# EAGLE design Adafruit TFP401 to 40pin TFT (EAGLE 6.3)
COMPANY: ADAFRUIT INDUSTRIES; DRAWN: FZHAO; REV: C
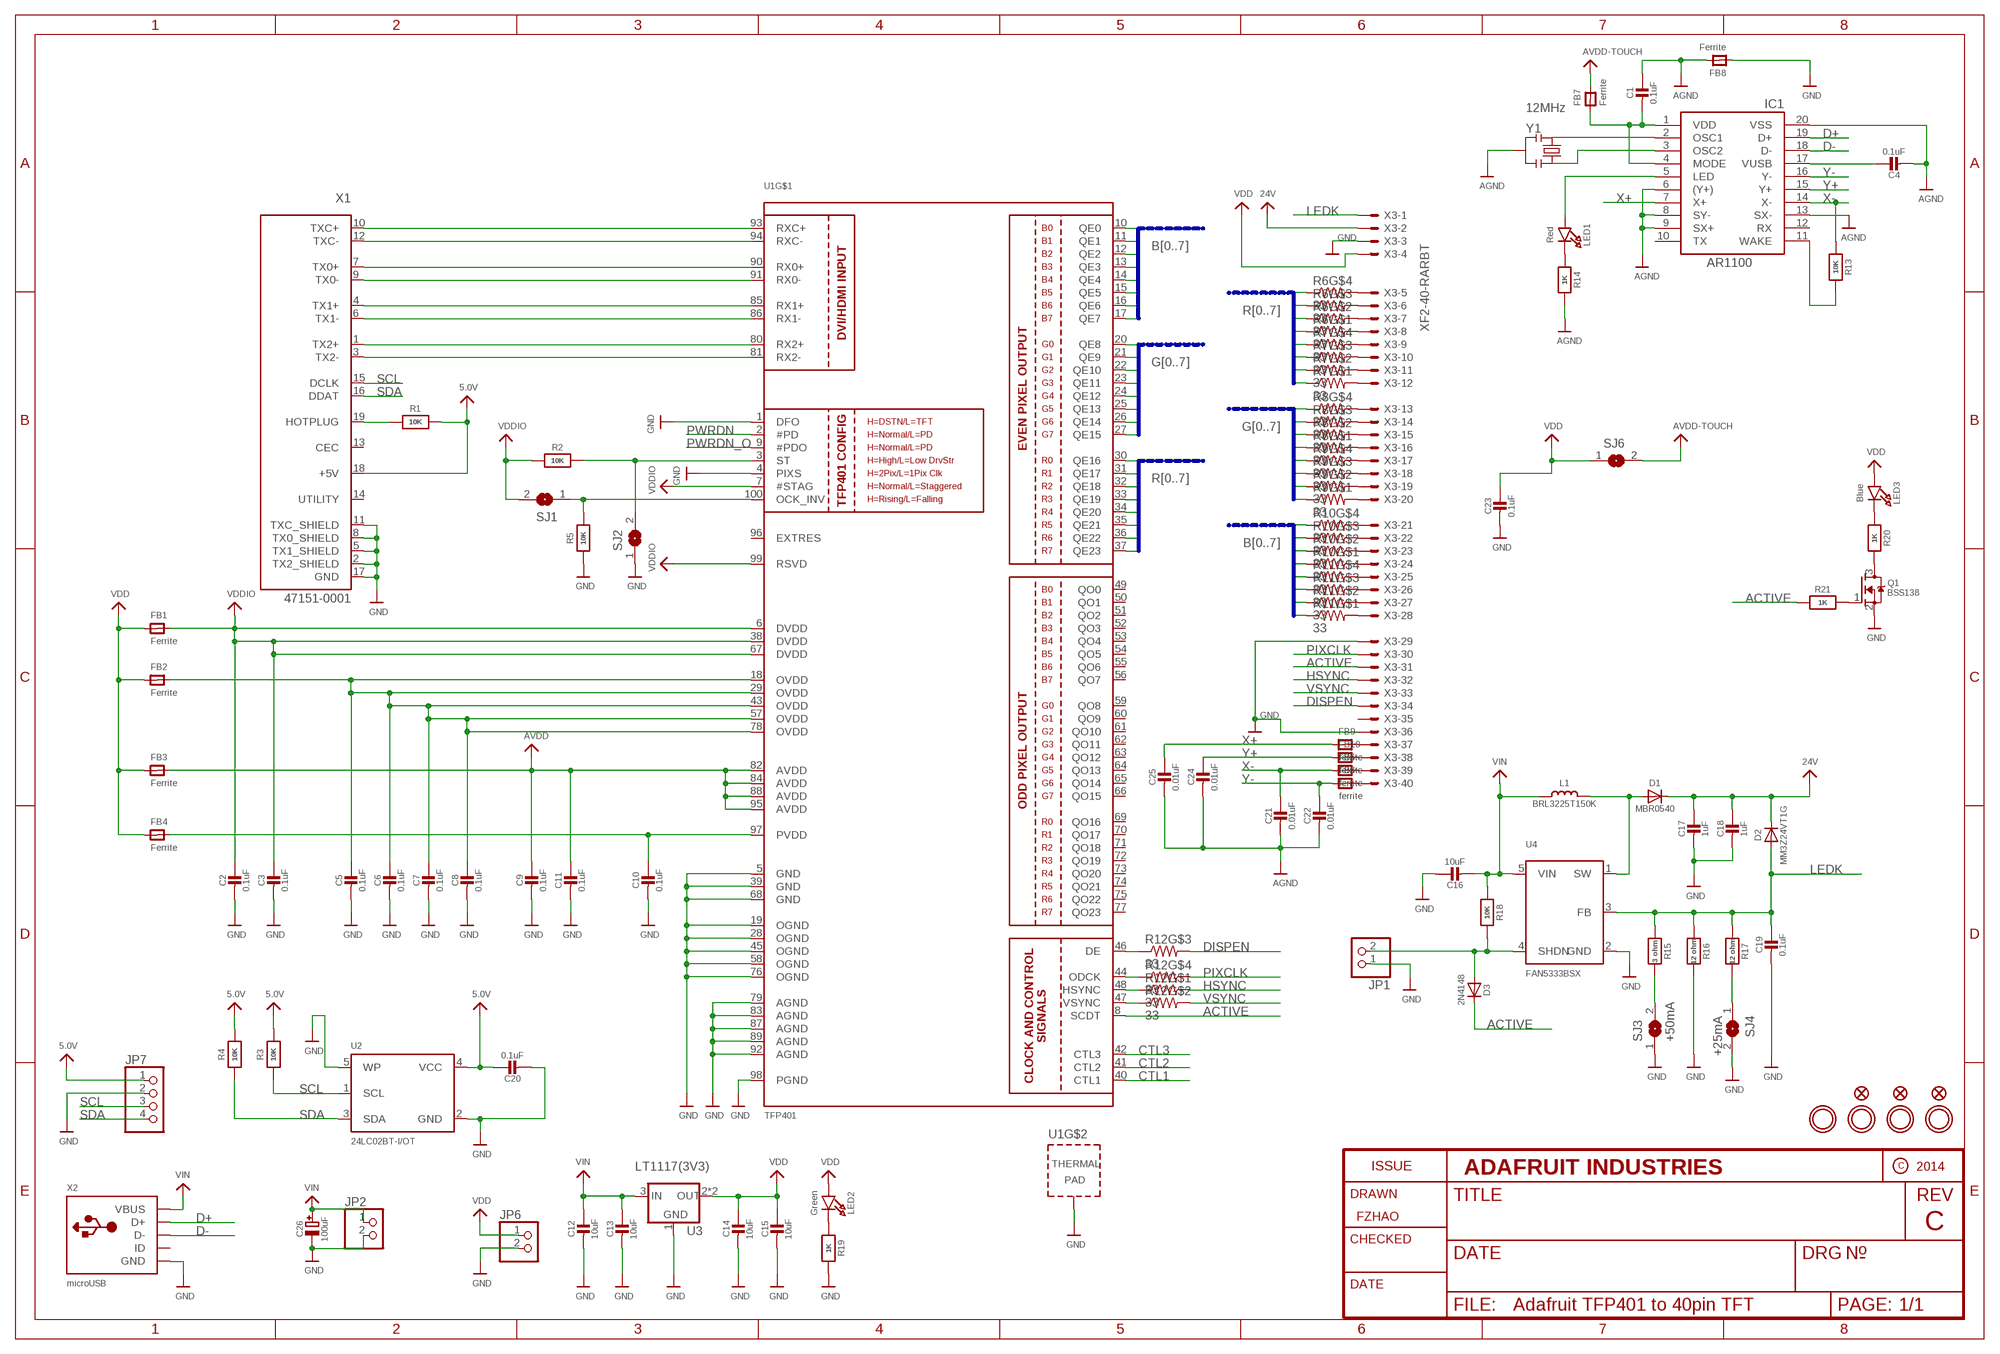
[diagram p0: schematic, sheet 1]

## Parts
C1  0.1uF  CAP_CERAMIC0805-NOOUTLINE  [0805-NO]
C2  0.1uF  CAP_CERAMIC0805-NOOUTLINE  [0805-NO]
C3  0.1uF  CAP_CERAMIC0805-NOOUTLINE  [0805-NO]
C4  0.1uF  CAP_CERAMIC0805-NOOUTLINE  [0805-NO]
C5  0.1uF  CAP_CERAMIC0805-NOOUTLINE  [0805-NO]
C6  0.1uF  CAP_CERAMIC_0805MP  [_0805MP]
C7  0.1uF  CAP_CERAMIC0805-NOOUTLINE  [0805-NO]
C8  0.1uF  CAP_CERAMIC0805-NOOUTLINE  [0805-NO]
C9  0.1uF  CAP_CERAMIC0805-NOOUTLINE  [0805-NO]
C10  0.1uF  CAP_CERAMIC0805-NOOUTLINE  [0805-NO]
C11  0.1uF  CAP_CERAMIC0805-NOOUTLINE  [0805-NO]
C12  10uF  CAP_CERAMIC0805-NOOUTLINE  [0805-NO]
C13  10uF  CAP_CERAMIC0805-NOOUTLINE  [0805-NO]
C14  10uF  CAP_CERAMIC0805-NOOUTLINE  [0805-NO]
C15  10uF  CAP_CERAMIC0805-NOOUTLINE  [0805-NO]
C16  10uF  CAP_CERAMIC0805-NOOUTLINE  [0805-NO]
C17  1uF  CAP_CERAMIC0805-NOOUTLINE  [0805-NO]
C18  1uF  CAP_CERAMIC0805-NOOUTLINE  [0805-NO]
C19  0.1uF  CAP_CERAMIC0805-NOOUTLINE  [0805-NO]
C20  0.1uF  CAP_CERAMIC0805-NOOUTLINE  [0805-NO]
C21  0.01uF  CAP_CERAMIC0805-NOOUTLINE  [0805-NO]
C22  0.01uF  CAP_CERAMIC0805-NOOUTLINE  [0805-NO]
C23  0.1uF  CAP_CERAMIC0805-NOOUTLINE  [0805-NO]
C24  0.01uF  CAP_CERAMIC0805-NOOUTLINE  [0805-NO]
C25  0.01uF  CAP_CERAMIC0805-NOOUTLINE  [0805-NO]
C26  100uF  CAP_ELECTROLYTICPANASONIC_C  [PANASONIC_C]
D1  MBR0540  DIODESOD-123  [SOD-123]
D2  MM3Z24VT1G  DIODESMA  [SMADIODE]
D3  2N4148  DIODESOD-323  [SOD-323]
FB1  Ferrite  FERRITE_0805MP  [_0805MP]
FB2  Ferrite  FERRITE_0805MP  [_0805MP]
FB3  Ferrite  FERRITE_0805MP  [_0805MP]
FB4  Ferrite  FERRITE_0805MP  [_0805MP]
FB5  ferrite  FERRITE_0805MP  [_0805MP]
FB6  ferrite  FERRITE_0805MP  [_0805MP]
FB7  Ferrite  FERRITE_0805MP  [_0805MP]
FB8  Ferrite  FERRITE_0805MP  [_0805MP]
FB9  ferrite  FERRITE_0805MP  [_0805MP]
FB10  ferrite  FERRITE_0805MP  [_0805MP]
FID1  FIDUCIAL""  [FIDUCIAL_1MM]
FID2  FIDUCIAL""  [FIDUCIAL_1MM]
FID3  FIDUCIAL""  [FIDUCIAL_1MM]
IC1  AR1100_SSOP  [TSSOP20-5.3MMBODY]
JP1  HEADER-1X2ROUND  [1X02_ROUND]
JP2  HEADER-1X2ROUND  [1X02_ROUND]
JP6  HEADER-1X2ROUND  [1X02_ROUND]
JP7  HEADER-1X476MIL  [1X04_ROUND_76]
L1  BRL3225T150K  INDUCTORNR5040  [INDUCTOR_5X5MM_NR5040_NOTHERMALS]
LED1  Red  LED0805_NOOUTLINE  [CHIPLED_0805_NOOUTLINE]
LED2  Green  LED0805_NOOUTLINE  [CHIPLED_0805_NOOUTLINE]
LED3  Blue  LED0805_NOOUTLINE  [CHIPLED_0805_NOOUTLINE]
Q1  BSS138  MOSFET-NREFLOW  [SOT23-R]
R1  10K  RESISTOR0805_NOOUTLINE  [0805-NO]
R2  10K  RESISTOR0805_NOOUTLINE  [0805-NO]
R3  10K  RESISTOR0805_NOOUTLINE  [0805-NO]
R4  10K  RESISTOR0805_NOOUTLINE  [0805-NO]
R5  10K  RESISTOR_0805MP  [_0805MP]
R6  33  RESISTOR_4PACK_US  [RESPACK_4X0603]
R7  33  RESISTOR_4PACK_US  [RESPACK_4X0603]
R8  33  RESISTOR_4PACK_US  [RESPACK_4X0603]
R9  33  RESISTOR_4PACK_US  [RESPACK_4X0603]
R10  33  RESISTOR_4PACK_US  [RESPACK_4X0603]
R11  33  RESISTOR_4PACK_US  [RESPACK_4X0603]
R12  33  RESISTOR_4PACK_US  [RESPACK_4X0603]
R13  10K  RESISTOR_0805MP  [_0805MP]
R14  1K  RESISTOR0805_NOOUTLINE  [0805-NO]
R15  3 ohm  RESISTOR0805_NOOUTLINE  [0805-NO]
R16  12 ohm  RESISTOR0805_NOOUTLINE  [0805-NO]
R17  12 ohm  RESISTOR0805_NOOUTLINE  [0805-NO]
R18  10K  RESISTOR0805_NOOUTLINE  [0805-NO]
R19  1K  RESISTOR0805_NOOUTLINE  [0805-NO]
R20  1K  RESISTOR0805_NOOUTLINE  [0805-NO]
R21  1K  RESISTOR0805_NOOUTLINE  [0805-NO]
SJ1  SOLDERJUMPER  [SOLDERJUMPER_ARROW_NOPASTE]
SJ2  SOLDERJUMPER  [SOLDERJUMPER_ARROW_NOPASTE]
SJ3  +50mA  SOLDERJUMPER  [SOLDERJUMPER_ARROW_NOPASTE]
SJ4  +25mA  SOLDERJUMPER  [SOLDERJUMPER_ARROW_NOPASTE]
SJ6  SOLDERJUMPERCLOSED  [SOLDERJUMPER_CLOSEDWIRE]
U1  TFP401  [S-PQFP-G100]
U2  24LC02BT-I/OT  EEPROM_I2C_MCP24AA32  [SOT23-5]
U3  LT1117(3V3)  VREG_SOT223  [SOT223-R]
U4  FAN5333BSX  VREG_FAN5331  [SOT23-5]
U$31  MOUNTINGHOLE3.0  [MOUNTINGHOLE_3.0_PLATED]
U$32  MOUNTINGHOLE3.0  [MOUNTINGHOLE_3.0_PLATED]
U$33  MOUNTINGHOLE3.0  [MOUNTINGHOLE_3.0_PLATED]
U$34  MOUNTINGHOLE3.0  [MOUNTINGHOLE_3.0_PLATED]
X1  47151-0001  HDMI_MOLEX_47151DIM  [HDMI_MOLEX_47151-0001_DIMLAYER]
X2  microUSB  USBMICRO_20329  [4UCONN_20329]
X3  XF2-40-RARBT  [4-1734839-0]
Y1  12MHz  RESONATORSMD  [RESONATOR-SMD]

## Nets
5.0V: C20.1 JP7.1 R1.2 R3.2 R4.2 U2.4(VCC) X1.18(+5V)
24V: C17.1 C18.1 D1.C D2.C X3.2
ACTIVE: D3.C R21.1 U1.8(SCDT) X3.31
AGND: C1.1 C4.2 C21.2 C22.2 C24.2 C25.2 FB8.2 IC1.6((Y+)) IC1.8(SY-) IC1.9(SX+) IC1.13(SX-) IC1.20(VSS) R14.2 Y1.2
ASD: R12.3 U1.46(DE)
AVDD: C9.1 C11.1 FB3.2 U1.82(AVDD) U1.84(AVDD) U1.88(AVDD) U1.95(AVDD)
AVDD2: FB7.2 SJ6.2 ; supply symbol labelled AVDD-TOUCH
B0: R10.4 U1.10(QE0)
B1: R10.3 U1.11(QE1)
B2: R10.2 U1.12(QE2)
B3: R10.1 U1.13(QE3)
B4: R11.4 U1.14(QE4)
B5: R11.3 U1.15(QE5)
B6: R11.2 U1.16(QE6)
B7: R11.1 U1.17(QE7)
CTL1: U1.40(CTL1)
CTL2: U1.41(CTL2)
CTL3: U1.42(CTL3)
CVB: R12.2 U1.47(VSYNC)
D+: IC1.19(D+) X2.D+
D-: IC1.18(D-) X2.D-
DISPEN: R12.6 X3.34
G0: R8.4 U1.20(QE8)
G1: R8.3 U1.21(QE9)
G2: R8.2 U1.22(QE10)
G3: R8.1 U1.23(QE11)
G4: R9.4 U1.24(QE12)
G5: R9.3 U1.25(QE13)
G6: R9.2 U1.26(QE14)
G7: R9.1 U1.27(QE15)
GND: C2.2 C3.2 C5.2 C6.2 C7.2 C8.2 C9.2 C10.2 C11.2 C12.2 C13.2 C14.2 C15.2 C16.1 C17.2 C18.2 C19.2 C20.2 C23.2 C26.- FB8.1 JP1.1 JP2.2 JP6.2 JP7.2 Q1.2(S) R5.1 R16.2 R19.2 SJ2.1 SJ3.1 SJ4.2 U1.1(DFO) U1.4(PIXS) U1.5(GND) U1.19(OGND) U1.28(OGND) U1.39(GND) U1.45(OGND) U1.58(OGND) U1.68(GND) U1.76(OGND) U1.79(AGND) U1.83(AGND) U1.87(AGND) U1.89(AGND) U1.92(AGND) U1.98(PGND) U1.P$1(TP) U1.P$2(TP) U1.P$3(TP) U1.P$4(TP) U1.P$5(TP) U1.P$6(TP) U1.P$7(TP) U1.P$8(TP) U1.P$9(TP) U1.P$10(TP) U1.P$11(TP) U1.P$12(TP) U1.P$13(TP) U1.P$14(TP) U1.P$15(TP) U1.P$16(TP) U1.THERMAL(TP) U2.2(GND) U2.5(WP) U3.1(GND) U4.2(GND) X1.2(TX2_SHIELD) X1.5(TX1_SHIELD) X1.8(TX0_SHIELD) X1.11(TXC_SHIELD) X1.17(GND) X2.BASE@1(GND) X2.BASE@2(GND) X2.GND X2.SPRT@1(GND) X2.SPRT@2(GND) X2.SPRT@3(GND) X2.SPRT@4(GND) X3.3 X3.29 X3.36
HSYNC: R12.8 X3.32
LEDK: C19.1 D2.A R15.1 R16.1 R17.1 U4.3(FB) X3.1
N$1: U1.93(RXC+) X1.10(TXC+)
N$2: U1.94(RXC-) X1.12(TXC-)
N$3: U1.90(RX0+) X1.7(TX0+)
N$4: U1.91(RX0-) X1.9(TX0-)
N$5: U1.85(RX1+) X1.4(TX1+)
N$6: U1.86(RX1-) X1.6(TX1-)
N$7: U1.80(RX2+) X1.1(TX2+)
N$8: U1.81(RX2-) X1.3(TX2-)
N$9: R1.1 X1.19(HOTPLUG)
N$10: IC1.2(OSC1) Y1.1
N$11: IC1.3(OSC2) Y1.3
N$12: C4.1 IC1.17(VUSB)
N$13: LED2.C R19.1
N$14: R6.5 X3.5
N$15: R6.6 X3.6
N$16: R6.7 X3.7
N$17: R6.8 X3.8
N$18: R7.5 X3.9
N$19: R7.6 X3.10
N$20: R7.7 X3.11
N$21: R7.8 X3.12
N$22: R8.5 X3.13
N$23: R8.6 X3.14
N$24: R8.7 X3.15
N$25: R8.8 X3.16
N$26: R9.5 X3.17
N$27: R9.6 X3.18
N$28: R9.7 X3.19
N$29: R9.8 X3.20
N$30: R10.5 X3.21
N$31: R10.6 X3.22
N$32: R10.7 X3.23
N$33: R10.8 X3.24
N$34: R11.5 X3.25
N$35: R11.6 X3.26
N$36: R11.7 X3.27
N$38: C10.1 FB4.2 U1.97(PVDD)
N$39: R11.8 X3.28
N$40: IC1.11(WAKE) R13.2
N$41: LED1.C R14.1
N$42: C5.1 C6.1 C7.1 C8.1 FB2.2 U1.18(OVDD) U1.29(OVDD) U1.43(OVDD) U1.57(OVDD) U1.78(OVDD)
N$43: IC1.5(LED) LED1.A
N$45: LED3.C R20.1
N$46: Q1.3(D) R20.2
N$47: D1.A L1.P$2 U4.1(SW)
N$48: Q1.1(G) R21.2
N$49: R15.2 SJ3.2
N$50: R17.2 SJ4.1
N$52: D3.A JP1.2 R18.2 U4.4(SHDN)
N$53: FB5.2 X3.39
N$54: FB6.2 X3.40
N$55: C1.2 FB7.1 IC1.1(VDD) IC1.4(MODE)
N$56: FB9.2 X3.37
N$57: FB10.2 X3.38
OCK_INV: R5.2 SJ1.1 U1.100(OCK_INV)
PIXCLK: R12.5 X3.30
PWRDN: U1.2(#PD)
PWRDN_O: U1.9(#PDO)
R0: R6.4 U1.30(QE16)
R1: R6.3 U1.31(QE17)
R2: R6.2 U1.32(QE18)
R3: R6.1 U1.33(QE19)
R4: R7.4 U1.34(QE20)
R5: R7.3 U1.35(QE21)
R6: R7.2 U1.36(QE22)
R7: R7.1 U1.37(QE23)
SCL: JP7.3 R3.1 U2.1(SCL) X1.15(DCLK)
SDA: JP7.4 R4.1 U2.3(SDA) X1.16(DDAT)
ST: R2.2 SJ2.2 U1.3(ST)
VDD: C14.1 C15.1 C23.1 FB1.1 FB2.1 FB3.1 FB4.1 JP6.1 LED2.A LED3.A SJ6.1 U3.2(OUT) U3.4(OUT) X3.4
VDDIO: C2.1 C3.1 FB1.2 R2.1 SJ1.2 U1.6(DVDD) U1.7(#STAG) U1.38(DVDD) U1.67(DVDD) U1.99(RSVD)
VIN: C12.1 C13.1 C16.2 C26.+ JP2.1 L1.P$1 R18.1 U3.3(IN) U4.5(VIN) X2.VBUS
VSYNC: R12.7 X3.33
X+: C25.1 FB9.1 IC1.7(X+)
X-: C21.1 FB5.1 IC1.14(X-) R13.1
XCV: R12.1 U1.48(HSYNC)
Y+: C24.1 FB10.1 IC1.15(Y+)
Y-: C22.1 FB6.1 IC1.16(Y-)
ZXC: R12.4 U1.44(ODCK)
Unconnected: IC1.10(TX) IC1.12(RX) U1.49(QO0) U1.50(QO1) U1.51(QO2) U1.52(QO3) U1.53(QO4) U1.54(QO5) U1.55(QO6) U1.56(QO7) U1.59(QO8) U1.60(QO9) U1.61(QO10) U1.62(QO11) U1.63(QO12) U1.64(QO13) U1.65(QO14) U1.66(QO15) U1.69(QO16) U1.70(QO17) U1.71(QO18) U1.72(QO19) U1.73(QO20) U1.74(QO21) U1.75(QO22) U1.77(QO23) U1.96(EXTRES) X1.13(CEC) X1.14(UTILITY) X2.ID X3.35

## Buses
B[0..7]
G[0..7]
R[0..7]

## Power pins joined to a net without a drawn wire
GND: X1.P$1(GND) X1.P$2(GND) X1.P$3(GND) X1.P$4(GND)

## Library data of the parts
C1-C25 = microbuilder:CAP_CERAMIC: Ceramic Capacitors For new designs, use the packages preceded by an '_' character since they are more reliable: The following footprints should be used on most boards: _0402 - Standard footprint for regular board layouts _0603 - Standard footprint for regular board layouts _0805 - Standard footprint for regular board layouts _1206 - Standard footprint for regular board layouts For extremely tight-pitch boards where space is at a premium, the following 'micro-pitch' footprints can be used (smaller pads, no silkscreen outline, etc.): _0402MP - Micro-pitch footprint for very dense/compact boards _0603MP - Micro-pitch footprint for very dense/compact boards _0805MP - Micro-pitch footprint for very dense/compact boards _1206MP - Micro-pitch footprint for very dense/compact boards
C26 = microbuilder:CAP_ELECTROLYTIC: Electrolytic Capacitors SMT PANASONIC_C - Size C Panasonic Electrolytic Aluminum Capacitor 47µF 16V 20% Electrolytic Capacitor [Digikey: PCE3890TR-ND] PANASONIC_D - Size D Panasonic Electrolytic Aluminum Capacitor 100µF 25V 20% Electrolytic Capacitor [Digikey: PCE3898TR-ND] PTH 3.5 mm grid, 8 mm diameter ... 3.5 mm grid, 10 mm diameter ...
D1-D3 = microbuilder:DIODE: Diode SMA Model Volts Amps Type Vf Ir Digikey # Notes SSA34-E3 40V 3A Schottky 480mV @ 3A 200uA @ 40V SSA34-E3/61TGITR-ND CDBA120-G 20V 1A Schottky 500mV @ 1A 500uA @ 20V 641-1014-6-ND REEL MBRA210 10V 2A Schottky 350mV @ 2A 700uA @ 10V MBRA210LT3 SOD-123 Model Volts Amps Type Vf Ir Order # Notes BAT54T1G 30V 200mA Schottky 800mV @ 200mA 2uA @ 25V BAT54T1GOSTR-ND B0530W 30V 500mA Schottky 430mV @ 500mA 130uA @ 30V B0530W-FDICT-ND REEL MBR120 20V 1A Schottky 340mV @ 1A MBR120VLSFT1GOSCT-ND SOD-323 Model Volts Amps Type Vf Ir Order # Notes PMEG2005EJ 20V 500mA Schottky 355mV @ 500mA 568-4110-1-ND ZLLS410 10V 570mA Schottky 380mV @ 570mA ZLLS410CT-ND 1N4148WS 75V 150mA Silicon/Simple 1V 1N4148WSFSCT-ND REEL SOD-523 Model Volts Amps Type Vf Ir Order # Notes BAT54XV2 30V 200mA Schottky 0.8V @ 100mA BAT54XV2CT-ND TB751S 30V 30mA Schottky RB751S-40TE61CT-ND SOT23-R/W (R = Solder Paste/Reflow Ovens, W = Hand-Soldering) Model Volts Amps Type Vf Ir Order # Notes BAT54FILM 40V 300mA Schottky 497-7162-1-ND POWERDI-5 Model Volts Amps Type Vf Ir Order # Notes PDS560 60V 5A Schottky 670mV @ 5A 150uA @ 60V PDS560DICT-ND
FB1-FB10 = microbuilder:FERRITE: Ferrite Bead 0603 MMZ1608B121C - 120 Ohm @ 100MHz, 600mA, 0.15 Ohm DC Resistance - Digikey: 445-2164-1-ND BK1608HW121-T - 120 Ohm, 600mA Ferrite Chip - Digikey: 587-1876-2-ND 0805 HZ0805B272R-10 - 2.7K Ohm @ 100MHz, 200mA, 0.8 Ohm DC Resistance - Digikey: 240-2504-1-ND (see also Murata BLM21BD272SN1L) MMZ2012Y152B - 1.5K Ohm @ 100MHz, 500mA, 0.4 Ohm DC Resistance - Digikey: 445-1560-1-ND - Mainly for high frequency (80-400MHz) MMZ2012R102A - 1K Ohm @ 100MHz, 500mA, 0.3 Ohm DC Resistance - Digikey: 445-1555-2-ND - More general purpose (10-200MHz)
FID1-FID3 = microbuilder:FIDUCIAL: Fiducial Alignment Points Various fiducial points for machine vision alignment.; BOM: EXCLUDE
IC1 = microbuilder:AR1100
JP1 JP2 JP6 = microbuilder:HEADER-1X2: PIN HEADER
JP7 = microbuilder:HEADER-1X4: PIN HEADER
L1 = microbuilder:INDUCTOR: Inductors 0603: 10nH Ceramic Inductor - microwire antenna/RF (Digikey: 712-1434-2-ND) 0805: 560nH Ceramic Inductor - RF (Digikey: 553-1047-1-ND) 270nH Ceramic Inductor - Q = 40@250MHz, +-5%, 1 Ohm DC Resistance (Digikey: 535-10506-2-ND) 1007 (2518 Metric) SMT: 10µH 10% 250mOhm 820mA 1007 Inductor (Digikey: 587-2189-1-ND) 22µH 10% 500mOhm 580mA 1007 Inductor (Digikey: 587-2190-1-ND) 47µH 10% 950mOhm 420mA 1007 Inductor (Digikey: 587-2191-1-ND) 47µH 5% 100mOhm 1A 1008 Inductor (Digikey: 732-1816-1-ND) 5.0x5.0mm (Taiyo Yuden NR5040 Series) 6.8µH 20% 2.3A 64mOhm Inductor (Digikey: 587-2374-2-ND) 5.0x5.0mm (TDK VLC5045 Series) 4.7µH 20% 3.3A 34mOhm Inductor (Digikey: 445-6526-1-ND) 6.8µH 20% 2.7A 46mOhm Inductor (Digikey: 445-6527-1-ND) 6.0x6.0mm (TDK VLC6045 Series) 4.7µH 20% 3.8A 27mOhm Inductor (Digikey: 445-6538-2-ND) 6.8µH 20% 3A 41mOhm Inductor (Digikey: 445-6540-1-ND) 6.2µH 30% 2.2A 45mOhm Inductor (Digikey: SRR5028-6R2YCT-ND) - Not TDK VLC6045 but footprint should match 6.0x6.0mm (TDK SLF6045 Series) 6.8uH 30% 2A 33mOhm Inductor (Digikey: 445-4572-1-ND, Mouser: 810-SLF645T6R8N2R0PF) 6.0x6.0mm (Sumida CDRH5D28 Series) 6.2uH 30% 1.8A 45mOhm Inductor (Digikey: 308-1542-1-ND) Taiyo Yuden NR3015T2R2M - 2.2uH 20% 1.5A (Digikey: 587-1648-2-ND, Mouser: 963-NR3015T2R2M) - Used with TI TPS62172 CoilCraft RFID Transponder Coil - MA5532-AE (For use with AS3935 Lightning Sensor) Vishay IHLP 1.0uH Molded Inductor - 24mOhm DCR, 5A, +/-20%, -55°C-125°C (Digikey: 541-1319-1-ND)
LED1-LED3 = microbuilder:LED: LED 0603 - 0603 Surface Mount Package 2mA: Green LED - Low Power (3.9mcd, 2ma, 1.7Vf) - Digikey: 475-2709-2-ND Orange LED - Low Power (9.8mcd, 2ma, 1.8Vf) - Digikey: 475-1194-2-ND Red LED - Low Power (5mcd, 2ma, 1.8Vf) - Digikey: 475-1195-2-ND Yellow LED - Low Power (7mcd, 2ma, 1.8Vf) - Digikey: 475-1196-2-ND 5mA: Blue LED - Low Power (17mcd, 5ma, 2.9Vf) - Digikey: LNJ937W8CRACT-ND 0805 - 0805 Surface Mount Package 2mA: Red LED (8.8mcd, 2mA, 1.8Vf, Clear) - Low Power [Digikey: 475-2510-1-ND] Green LED (5mcd, 2mA, 1.8Vf, Clear) - Low Power [Digikey: 475-2730-1-ND] Yellow LED (11.3mcd, 2mA, 1.8Vf, Clear) - Low Power [Digikey: 475-2555-1-ND] 20mA: Red LED (104mcd, 20mA, Diffused) - LS R976 [Digikey: 475-1278-6-ND] Red LED (12mcd, 20mA, 2.0Vf, Clear) - APT2012EC [Digikey: 754-1128-1-ND] Green LED (15mcd, 20mA, 2.2Vf, Clear) - APT2012GC [Digikey: 754-1131-1-ND] Orange LED (160mcd, 20mA, 2.1Vf, Clear) - APT2012SECK [Digikey: 754-1130-1-ND] 1206 - 1206 Surface Mount Package Green LED (26mcd, 20mA, Diffused) - LG N971 [Digikey: 475-1407-6-ND] Red LED (15mcd, 20mA, Diffused) - LH N974 [Digikey: 475-1416-6-ND] Cree - Cree High-Power Surface Mount LEDs XPEBWT-L1-0000-00D50 - White 111lm 350mA 2.9Vf 6200K 110° XTEAWT-00-0000-00000LEE3 - White 114lm 350mA 2.85Vf 5000K 115° Everlight - Everlight 45-21 Series Surface Mount LEDs 45-21/QK2C-B2832AC2CB2/2T - Warm White 2000mcd 20mA 3.25Vf 3050K 120° 45-21/LK2C-B38452C4CB2/2T - Nuetral White 2000mcd 20mA 3.25Vf 4150K 120° 45-21/LK2C-B50634C6CB2/2T - Cold White 2200mcd 20mA 3.25Vf 5650K 120° PLCC2 Reverse Mount LS T77K-J1L2-1-0-2-R18-Z - Red 11.25mcd 2mA 1.8Vf 630nm 120° LO T77K-L1M2-24-Z - Orange 19.6mcd 2mA 1.8Vf 606nm 120° LY T77K-K2M1-26-Z - Yellow 15.7mcd 2mA 1.8Vf 587nm 120°
Q1 = microbuilder:MOSFET-N: N-Channel Mosfet LEGEND VDS: Voltage Drain-Source ID: Drain Current RDS(ON): Drain-Source On-State Resistance VGS(TH): Gate-Source Threshold Voltage CISS: Drain-Source Input Capacitance SOT-23 Name VDS ID RDS(ON) VGS(TH) CISS Order Number 2N7002E 60V 260mA 2.5 Ohm 2.5V @ 250uA 26.7pF @ 25V 2N7002ET1GOSTR-ND BSH103 30V 850mA 400 mOhm 400mV @ 1mA 83pF @ 24V BSH103,235-ND BSS138 60V 320mA 1.6 Ohm 1.5V @ 250uA 50pF @ 10V Mouser: 771-BSS138PW115 DMN2075U-7 20V 4.2A 38 mOhm 1V @ 250 uA 594.3pF @ 10V DMN2075U-7DICT-ND * BSS138 good choice for I2C level-shifting POWERPAK 1212-8 Name VDS ID RDS(ON) VGS(TH) CISS Order Number Si7308DN 60V 6A 58 mOhm 3V @ 250uA 665pF @ 15V SI7308DN-T1-E3CT-ND
R1-R5 R13-R21 = microbuilder:RESISTOR: Resistors For new designs, use the packages preceded by an '_' character since they are more reliable: The following footprints should be used on most boards: _0402 - Standard footprint for regular board layouts _0603 - Standard footprint for regular board layouts _0805 - Standard footprint for regular board layouts _1206 - Standard footprint for regular board layouts For extremely tight-pitch boards where space is at a premium, the following 'micro-pitch' footprints can be used (smaller pads, no silkscreen outline, etc.): _0402MP - Micro-pitch footprint for very dense/compact boards _0603MP - Micro-pitch footprint for very dense/compact boards _0805MP - Micro-pitch footprint for very dense/compact boards _1206MP - Micro-pitch footprint for very dense/compact boards
R6-R12 = microbuilder:RESISTOR_4PACK_US: Resistor Packs (4 resistors) 4 x 0603 10K 1/16W - Digikey: YC164J-10KCT-ND
SJ1-SJ4 = microbuilder:SOLDERJUMPER: SMD Solder JUMPER Solder the two pads together to create a connection, or remove the solder to break it. REFLOW - Use this footprint for solder paste and reflow ovens. WAVE - Use this footprint for hand-soldering (larger pads). CLOSED - Has a trace between the two pads to ensure it is closed by default. The trace needs to be cut to disable the jumper, and can be closed again by creating a solder bridge between the two pads.; BOM: EXCLUDE
SJ6 = microbuilder:SOLDERJUMPER: SMD Solder JUMPER Solder the two pads together to create a connection, or remove the solder to break it. REFLOW - Use this footprint for solder paste and reflow ovens. WAVE - Use this footprint for hand-soldering (larger pads). CLOSED - Has a trace between the two pads to ensure it is closed by default. The trace needs to be cut to disable the jumper, and can be closed again by creating a solder bridge between the two pads.
U1 = microbuilder:TFP401: TFP401 PanelBus Digital Receiver Supports Pixel Rates Up to 165 MHz (Including 1080p and WUXGA at 60Hz) Supply Voltage: 3.0-3.6V Operating Temperature: 0-70°C (EP version exists with -55-125°C)
U2 = microbuilder:EEPROM_I2C_MCP24AA32: Microchip 32K (4K x 8) 1.8V I2C EEPROM SOT23-5 [Digikey: 24AA32AFT-I/OTCT-ND]
U3 = microbuilder:VREG_SOT223: SOT-223 Fixed Voltage Regulators Part Current Out V Out V In V Dropout θJA (°C/W) TJ (°C) Operating Temp Digikey Part No. AP1117 1A 3.3V 18V 1.1V@500mA, 1.3V@1A 107°C/W 150°C -40°C-125°C AP1117IE33G-13DICT-ND Max operating temp can be calculated using θJA, TJ (max junction temperature), and power in watts. Set the "Maximum Ambient Temperature" until it reaches TJ ("Max Junction Temperature"), which is the absolute limit for safe use of the regulator: Heat Sink Temperature Calculator <http://www.daycounter.com/Calculators/Heat-Sink-Temperature-Calculator.phtml> For example, With 12V source into a 3.3V LP2985 and a 30mA load, we are dissipating (12V-3.3V) * 0.03A = 0.261W. With a θJA of 206 °C/W, a TJ of 150°C, and 261mW we can safely use the chip without a heat sink up to 75°C (=147.1°C Junction Temperature).
U4 = microbuilder:VREG_FAN5331: FAN5331 - LED/OLED 20V Boost Converter Digikey: FAN5331SXCT-ND
U$31-U$34 = microbuilder:MOUNTINGHOLE: Mounting Hole For #2 screws (0.086"/2.18mm width, 0.094"/2.4mm hole) use 2.5mm; BOM: EXCLUDE
X1 = microbuilder:HDMI_MOLEX_47151: The default footprint uses layer 46 (Milling) for the tabs, the DIMLAYER footprint uses layer 20 (Dimensions). Both will probably require special instructions to the board house
X2 = microbuilder:USB: USB Connectors USBMINIB - Surface Mount Female Mini-B USB Connector 4UConnector: 06564
X3 = adafruit:XF2*-40?: OMRON FPC Connector Source : http://www.omron.com/ecb/products/pdf/fpc.pdf XF2M-4015-rev is good for connecting up 'PSP' SHARP LQ043 LCDs
Y1 = SparkFun:RESONATOR: Resonator Small SMD resonator. This is the itty bitty 10/20MHz resonators with built in caps. CSTCE10M0G55 and CSTCE20M0V53. Footprint has been reviewed closely but hasn't been tested yet.

## Board
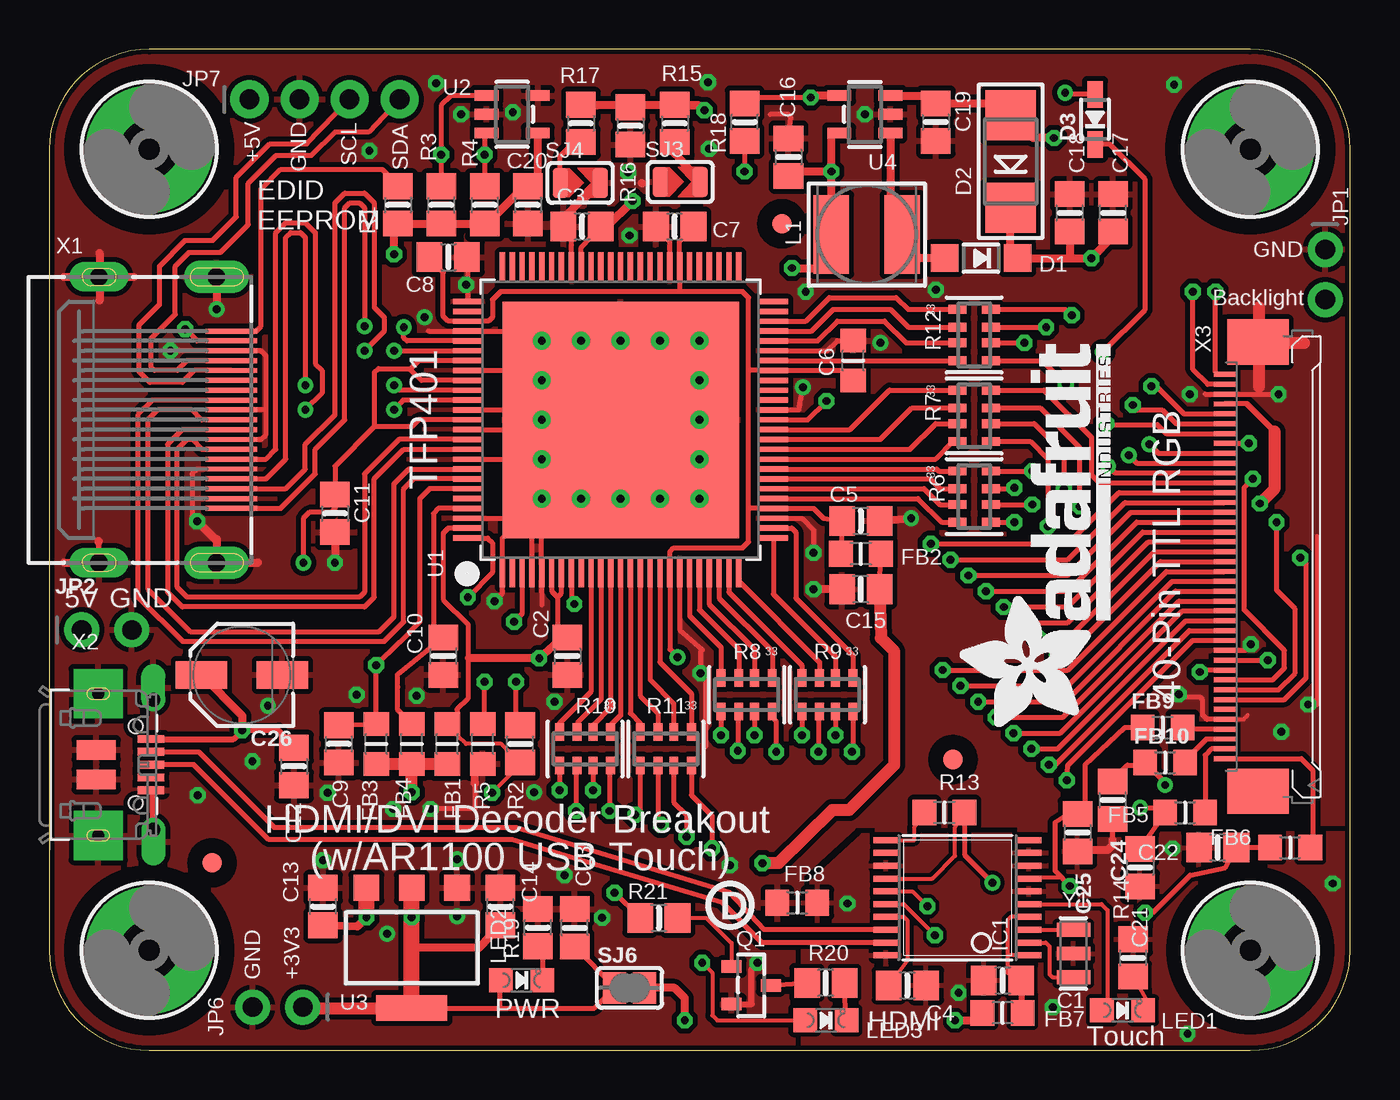
[diagram p1: board, top side]
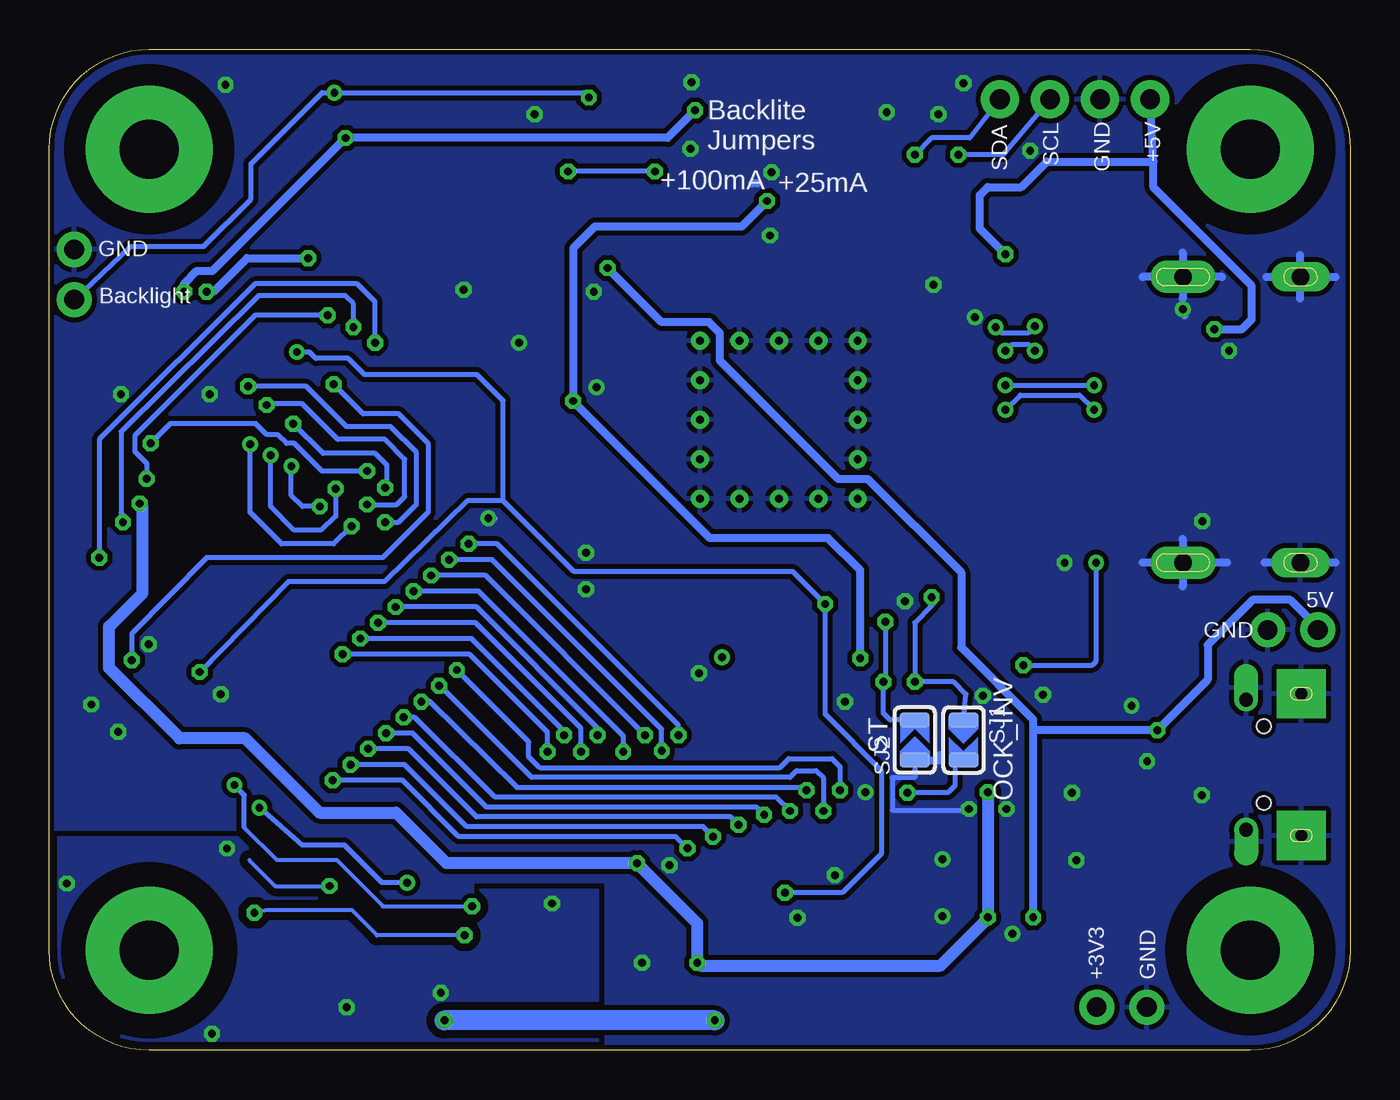
[diagram p2: board, bottom side, seen from below]

Size 66.04 x 50.8 mm. Coordinates in mm from the lower left corner, seen from the top.
Outline: 0,45.72 0,5.08 arc90 5.08,0 60.96,0 arc90 66.04,5.08 66.04,45.72 arc90 60.96,50.8 5.08,50.8 arc90 0,45.72
Copper layers (1*16): Top 0.035mm / dielectric 1.5mm / Bottom 0.035mm
Design rules "adafruit": minimum track width 8mil, minimum drill 15.5mil, track to track 8mil, track to pad 8mil, pad to pad 8mil, via to via 8mil, smd to smd 8mil, copper to edge 10mil, drill to drill 8mil, minimum pad ring 10mil, minimum via ring 8mil, stop-mask expansion 2mil, vias tented up to drill 20mil, thermal gap 10mil
tRestrict: area 24.7,24.1 to 24.8,24.4; area 7,19.9 to 7.5,20; area 22.1,34.8 to 22.9,36.2; area 22.2,32.8 to 22.9,34.2; area 22.2,31.8 to 22.7,32.3; area 22.2,30.2 to 22.9,31.1; area 22.4,27.3 to 22.7,29.7; area 23.2,25.3 to 24.3,25.9; area 25.3,25.3 to 31.1,25.8; area 49.5,9.7 to 49.9,9.8; 1 lines

### Footprints (pad centres in the part's own frame; a part is rotated, then mirrored left to right if it is on the bottom)
0805-NO = smd 1.3 x 1.5: 1 -0.95,0; 2 0.95,0
_0805MP = smd 1.2 x 1.3: 1 -1.016,0; 2 1.016,0
PANASONIC_C = smd 2.6 x 1.4: + 2.05,0; - -2.05,0
SOD-123 = smd 1.4 x 1.4: A 1.85,0; C -1.85,0
SMADIODE = smd 2.54 x 2.54: A 2.349,0; C -2.349,0
SOD-323 = smd 1.35 x 0.8: A 1.27,0; C -1.27,0
FIDUCIAL_1MM = smd 1 x 1: 1 0,0
TSSOP20-5.3MMBODY = smd 0.305 x 1.27: 1 -2.925,-3.618; 2 -2.275,-3.618; 3 -1.625,-3.618; 4 -0.975,-3.618; 5 -0.325,-3.618; 6 0.325,-3.618; 7 0.975,-3.618; 8 1.625,-3.618; 9 2.275,-3.618; 10 2.925,-3.618; 11 2.925,3.618; 12 2.275,3.618; 13 1.625,3.618; 14 0.975,3.618; 15 0.325,3.618; 16 -0.325,3.618; 17 -0.975,3.618; 18 -1.625,3.618; 19 -2.275,3.618; 20 -2.925,3.618
1X02_ROUND = drill 1 pad 1.778: 1 -1.27,0; 2 1.27,0
1X04_ROUND_76 = drill 1 pad 1.93: 1 -3.81,0; 2 -1.27,0; 3 1.27,0; 4 3.81,0
INDUCTOR_5X5MM_NR5040_NOTHERMALS = smd 1.8 x 4: P$1 -1.8,0; P$2 1.8,0
CHIPLED_0805_NOOUTLINE = smd 1.2 x 1.2: A 0,-1.05; C 0,1.05
SOT23-R = smd 0.635 x 1.016: 1 -0.95,-1; 2 0.95,-1; 3 0,1
RESPACK_4X0603 = smd 0.45 x 0.9: 1 -1.3,-0.85; 2 -0.4,-0.85; 3 0.4,-0.85; 4 1.3,-0.85; 5 1.3,0.85; 6 0.4,0.85; 7 -0.4,0.85; 8 -1.3,0.85
SOLDERJUMPER_ARROW_NOPASTE = smd 0.762 x 1.524: 1 -1.016,0; 2 1.016,0
SOLDERJUMPER_CLOSEDWIRE = smd 1.168 x 1.6: 1 -0.762,0; 2 0.762,0 | smd 0.635 x 0.203: WIRE 0,0
S-PQFP-G100 = smd 0.27 x 1.5: 1 -6,-7.75; 2 -5.5,-7.75; 3 -5,-7.75; 4 -4.5,-7.75; 5 -4,-7.75; 6 -3.5,-7.75; 7 -3,-7.75; 8 -2.5,-7.75; 9 -2,-7.75; 10 -1.5,-7.75; 11 -1,-7.75; 12 -0.5,-7.75; 13 0,-7.75; 14 0.5,-7.75; 15 1,-7.75; 16 1.5,-7.75; 17 2,-7.75; 18 2.5,-7.75; 19 3,-7.75; 20 3.5,-7.75; 21 4,-7.75; 22 4.5,-7.75; 23 5,-7.75; 24 5.5,-7.75; 25 6,-7.75; 51 6,7.75; 52 5.5,7.75; 53 5,7.75; 54 4.5,7.75; 55 4,7.75; 56 3.5,7.75; 57 3,7.75; 58 2.5,7.75; 59 2,7.75; 60 1.5,7.75; 61 1,7.75; 62 0.5,7.75; 63 0,7.75; 64 -0.5,7.75; 65 -1,7.75; 66 -1.5,7.75; 67 -2,7.75; 68 -2.5,7.75; 69 -3,7.75; 70 -3.5,7.75; 71 -4,7.75; 72 -4.5,7.75; 73 -5,7.75; 74 -5.5,7.75; 75 -6,7.75 | smd 1.5 x 0.27: 26 7.75,-6; 27 7.75,-5.5; 28 7.75,-5; 29 7.75,-4.5; 30 7.75,-4; 31 7.75,-3.5; 32 7.75,-3; 33 7.75,-2.5; 34 7.75,-2; 35 7.75,-1.5; 36 7.75,-1; 37 7.75,-0.5; 38 7.75,0; 39 7.75,0.5; 40 7.75,1; 41 7.75,1.5; 42 7.75,2; 43 7.75,2.5; 44 7.75,3; 45 7.75,3.5; 46 7.75,4; 47 7.75,4.5; 48 7.75,5; 49 7.75,5.5; 50 7.75,6; 76 -7.75,6; 77 -7.75,5.5; 78 -7.75,5; 79 -7.75,4.5; 80 -7.75,4; 81 -7.75,3.5; 82 -7.75,3; 83 -7.75,2.5; 84 -7.75,2; 85 -7.75,1.5; 86 -7.75,1; 87 -7.75,0.5; 88 -7.75,0; 89 -7.75,-0.5; 90 -7.75,-1; 91 -7.75,-1.5; 92 -7.75,-2; 93 -7.75,-2.5; 94 -7.75,-3; 95 -7.75,-3.5; 96 -7.75,-4; 97 -7.75,-4.5; 98 -7.75,-5; 99 -7.75,-5.5; 100 -7.75,-6 | drill 0.4: P$1 -4,4; P$2 -2,4; P$3 0,4; P$4 2,4; P$5 4,4; P$6 4,2; P$7 4,0; P$8 4,-2; P$9 4,-4; P$10 2,-4; P$11 0,-4; P$12 -2,-4; P$13 -4,-4; P$14 -4,-2; P$15 -4,0; P$16 -4,2 | smd 12 x 12: THERMAL 0,0
SOT23-5 = smd 0.55 x 1.2: 1 -0.95,-1.3; 2 0,-1.3; 3 0.95,-1.3; 4 0.95,1.3; 5 -0.95,1.3
SOT223-R = smd 1.3 x 1.3: 1 -2.3,-3.05; 2 0,-3.05; 3 2.3,-3.05 | smd 3.6 x 1.3: 4 0,3.05
MOUNTINGHOLE_3.0_PLATED = drill 3 pad 6.452: P$1 0,0
HDMI_MOLEX_47151-0001_DIMLAYER = smd 0.25 x 2.6: 1 4.5,0; 2 4,0; 3 3.5,0; 4 3,0; 5 2.5,0; 6 2,0; 7 1.5,0; 8 1,0; 9 0.5,0; 10 0,0; 11 -0.5,0; 12 -1,0; 13 -1.5,0; 14 -2,0; 15 -2.5,0; 16 -3,0; 17 -3.5,0; 18 -4,0; 19 -4.5,0 | drill 0.9 pad 1.65 long: P$1 -7.25,-0.76; P$2 7.25,-0.76 | drill 0.9 pad 1.5 long: P$3 7.25,-6.72; P$4 -7.25,-6.72
4UCONN_20329 = smd 1 x 2: BASE@1 -0.75,-2; BASE@2 0.75,-2 | smd 0.4 x 1.35: D+ 0,0.775; D- -0.65,0.775; GND 1.3,0.775; ID 0.65,0.775; VBUS -1.3,0.775 | drill 0.7 offset: SPRT@1 -3.3,0.9; SPRT@2 3.3,0.9 | drill 0.6 pad 2.5 square: SPRT@3 -3.6,-1.9; SPRT@4 3.6,-1.9 | hole 0.7: -1.95,0; 1.95,0
4-1734839-0 = smd 0.25 x 1.1: 1 -9.75,-2.54; 2 -9.25,-2.54; 3 -8.75,-2.54; 4 -8.25,-2.54; 5 -7.75,-2.54; 6 -7.25,-2.54; 7 -6.75,-2.54; 8 -6.25,-2.54; 9 -5.75,-2.54; 10 -5.25,-2.54; 11 -4.75,-2.54; 12 -4.25,-2.54; 13 -3.75,-2.54; 14 -3.25,-2.54; 15 -2.75,-2.54; 16 -2.25,-2.54; 17 -1.75,-2.54; 18 -1.25,-2.54; 19 -0.75,-2.54; 20 -0.25,-2.54; 21 0.25,-2.54; 22 0.75,-2.54; 23 1.25,-2.54; 24 1.75,-2.54; 25 2.25,-2.54; 26 2.75,-2.54; 27 3.25,-2.54; 28 3.75,-2.54; 29 4.25,-2.54; 30 4.75,-2.54; 31 5.25,-2.54; 32 5.75,-2.54; 33 6.25,-2.54; 34 6.75,-2.54; 35 7.25,-2.54; 36 7.75,-2.54; 37 8.25,-2.54; 38 8.75,-2.54; 39 9.25,-2.54; 40 9.75,-2.54 | smd 2.3 x 3.1: M1 11.4,-0.84; M2 -11.4,-0.84
RESONATOR-SMD = smd 0.7 x 1.7: 1 -1.2,0; 2 0,0; 3 1.2,0

### Placement (x,y rotation side)
C1  48.39,3.56 0 top
C2  26.3,20 270 top
C3  27.05,41.8 180 top
C4  43.56,3.3 0 top
C5  41.2,26.87 0 top
C6  40.8,35 90 top
C7  31.75,41.8 180 top
C8  20.25,40.25 0 top
C9  14.7,15.55 270 top
C10  20,20 270 top
C11  14.5,27.25 270 top
C12  12.42,14.41 270 top
C13  13.9,7.3 90 top
C14  22.9,7.3 90 top
C15  41.2,23.4 180 top
C16  37.52,45.33 270 top
C17  54,42.5 90 top
C18  51.8,42.5 90 top
C19  45,47.1 270 top
C20  24.3,42.9 270 top
C21  55.37,9.27 270 top
C22  59.31,10.29 180 top
C23  26.67,6.22 90 top
C24  53.98,12.7 270 top
C25  52.2,11.05 270 top
C26  9.78,19.05 180 top
D1  47.3,40.2 180 top
D2  48.8,45.1 90 top
D3  53.09,47.24 90 top
FB1  20.2,15.55 90 top
FB2  41.2,25.2 180 top
FB3  16.6,15.55 90 top
FB4  18.4,15.55 90 top
FB5  57.66,12.06 0 top
FB6  62.99,10.29 0 top
FB7  48.39,1.91 180 top
FB8  37.97,7.49 0 top
FB9  56.52,16.38 0 top
FB10  56.64,14.61 0 top
FID1  37.19,41.95 0 top
FID2  8.26,9.51 0 top
FID3  45.88,14.76 0 top
IC1  46.1,7.75 90 top
JP1  64.77,39.37 270 top
JP2  2.92,21.34 0 top
JP6  11.6,2.2 180 top
JP7  13.97,48.26 0 top
L1  41.5,41.4 0 top
LED1  54.48,2.04 270 top
LED2  23.98,3.56 270 top
LED3  39.42,1.53 270 top
Q1  35.63,3.3 270 top
R1  17.7,42.9 270 top
R2  23.9,15.55 90 top
R3  19.9,42.9 270 top
R4  22.1,42.9 270 top
R5  22,15.55 90 top
R6  46.95,28.1 270 top
R7  46.95,32.2 270 top
R8  35.4,18.05 180 top
R9  39.5,18.05 180 top
R10  27.2,15.3 180 top
R11  31.3,15.3 180 top
R12  46.95,36.3 270 top
R13  45.44,12.06 180 top
R14  55.02,4.69 90 top
R15  31.75,47.03 270 top
R16  29.5,46.91 270 top
R17  26.99,47.03 270 top
R18  35.3,47.1 90 top
R19  24.8,6.23 90 top
R20  39.42,3.43 180 top
R21  30.94,6.73 0 top
SJ1  19.63,15.75 270 bottom
SJ2  22.1,15.75 90 bottom
SJ3  32.03,44.06 0 top
SJ4  26.95,44.02 0 top
SJ6  29.46,3.17 0 top
U1  29,32 0 top
U2  23.5,47.5 270 top
U3  18.4,5.2 180 top
U4  41.4,47.5 90 top
U$31  5.08,45.72 0 top
U$32  60.96,45.72 0 top
U$33  60.96,5.08 0 top
U$34  5.08,5.08 0 top
U$80  [PCBFEAT-REV-056]  34.54,7.37 0 top
U$81  [ADAFRUIT_TEXT_20MM]  53.85,16.26 90 top
X1  9.25,32 270 top
X2  4.38,14.5 270 top
X3  62.2,24.55 270 top
Y1  51.99,4.92 90 top

### Tracks (layer width: path | path; a pad name or v marks a point on that pad's centre or on a via)
5.0V  (via drill 0.4)
  Top 0.25: X1.18 7.5,36 v6.9,36.6
  Top 0.406: v17.5,40.4 17.5,41.88 R1.2 R3.2 R4.2 22.18,41.88 24.22,43.92 C20.1 24.8,44.42 U2.4
  Bottom 0.406: v6.9,36.6 5.5,36.6 5,37.1 5,38.8 9.99,43.79 9.99,45.1 | v17.5,40.4 18.8,41.7 18.8,43.4 18.4,43.8 16.7,43.8 15.4,45.1 9.99,45.1 | 9.99,45.1 JP7.1
24V  (via drill 0.4)
  Top 0.254: X3.2 58.8,33.8 58.05,34.55 v58.05,38.5
  Top 0.406: C17.1 54,41.3 v52.9,40.2 51.8,40.2 | 51.45,41.1 51.8,41.45 C18.1 51.8,40.2 | D2.C 48.8,40.55 D1.C 51.8,40.2
  Bottom 0.406: v58.05,38.5 57.7,38.5 56,40.2 v52.9,40.2
ACTIVE  (via drill 0.39, 0.4)
  Top 0.254: U1.8 26.5,22.65 v26.65,22.65 | X3.31 58.5,19.3 v58.4,19.2 | R21.1 29.93,6.78 v28.7,8 | v53.47,35.43 55.63,37.59 55.63,44.2 53.85,45.97 D3.C
  Bottom 0.254: 43,27.9 39.4,24.3 28.3,24.3 v26.65,22.65 26.65,17.05 23.8,14.2 23.8,9.98 25.78,8 v28.7,8 | 43,27.9 44.8,27.9 49.01,23.79 53.91,23.79 v58.4,19.2 | 43,27.9 43,32.97 44.32,34.29 50.04,34.29 50.86,35.12 52.51,35.12 52.83,35.43 v53.47,35.43
AGND  (via drill 0.4)
  Top 0.254: C24.2 53.98,10.67
  Top 0.406: 53.98,10.67 53.98,10.41 53.72,10.16 52.2,10.16 52.07,10.03 52.13,10.03 C25.2
  other vias: 46.16,2.92 57.02,10.25 50.95,2.19 65.15,8.47 40.51,7.45 57.78,0.85
  pour Top (isolate 0.203): 66.04,11.05 41.27,10.92 38.23,8.13 38.23,0 66.04,0
  pour Bottom (isolate 0.406): 65.91,10.79 49.02,10.79 46.35,8.13 38.23,8.13 38.23,0 66.04,0
ASD
  Top 0.254: U1.46 39,36 40,37 42.4,37 43.5,35.9 R12.3
AVDD  (via drill 0.4)
  Top 0.25: U1.88 18.75,32 18.4,31.65 16.5,31.65 | 16.5,31.65 14.5,29.65 C11.1 14.5,27.5 14.3,27.3 13.2,27.3 12.9,27 v12.9,24.75 | 16.5,31.65 16.5,34.4 16.7,34.6 18.35,34.6 | U1.82 18.75,35 18.35,34.6 | U1.84 18.9,34 18.35,34.55 18.35,34.6 | U1.95 19.3,28.5 18.8,28 18.8,21.74 17.75,20.69 v16.6,19.55
  Top 0.254: v16.6,19.55 FB3.2 C9.1
  Bottom 0.25: v16.6,19.55 13.1,19.55 12.9,19.75 v12.9,24.75
AVDD2  (via drill 0.4)
  Top 0.406: v45.97,1.52 47.62,1.52 FB7.2 | v32.26,1.52 32.26,2.67 31.75,3.17 SJ6.2
  Bottom 1.016: v32.26,1.52 v45.97,1.52
B0
  Top 0.254: U1.10 27.5,18.2 25.9,16.6 R10.4
B1
  Top 0.254: U1.11 28,17.8 26.8,16.6 R10.3
B2
  Top 0.254: U1.12 28.5,17.4 27.6,16.5 R10.2
B3
  Top 0.254: U1.13 29,17 28.5,16.5 R10.1
B4
  Top 0.254: U1.14 29.5,17.1 30,16.6 R11.4
B5
  Top 0.254: U1.15 30,18 30.9,17.1 R11.3
B6
  Top 0.254: U1.16 30.5,18.8 31.7,17.6 R11.2
B7
  Top 0.254: U1.17 31,19.7 32.6,18.1 R11.1
CVB
  Top 0.254: U1.47 38.7,36.5 39.8,37.6 42.7,37.6 43.6,36.7 R12.2
D+
  Top 0.254: X2.D+ 7.34,14.5 11.14,10.7 23.5,10.7 34.16,7.49 36.18,5.47 IC1.19
D-
  Top 0.254: IC1.18 36.3,6.12 34.54,8 23.7,11.3 11.44,11.3 7.59,15.15 X2.D-
DISPEN  (via drill 0.4)
  Top 0.254: X3.34 62.7,17.8 63.8,18.9 63.8,24.7 v63.5,25 | R12.6 v49.5,35.9
  Bottom 0.254: v49.5,35.9 49.5,38 50.4,38.9 55.6,38.9 63.5,31 v63.5,25
G0
  Top 0.254: U1.20 32.5,22.05 34.1,20.45 R8.4
G1
  Top 0.254: U1.21 33,22.35 35,20.35 R8.3
G2
  Top 0.254: U1.22 33.5,22.65 35.8,20.35 R8.2
G3
  Top 0.254: U1.23 34,22.95 36.7,20.25 R8.1
G4
  Top 0.254: U1.24 34.5,23.25 38.2,19.55 R9.4
G5
  Top 0.254: U1.25 35,23.8 39.1,19.7 R9.3
G6
  Top 0.254: U1.26 36.75,23.15 39.9,20 R9.2
G7
  Top 0.254: U1.27 37.7,26.5 37.9,26.3 37.9,22.95 40.8,20.05 R9.1
GND  (via drill 0.4)
  Top 0.203: 64.35,26.1 64.35,17.8 | X3.36 60.62,16.8 60.83,17.02
  Top 0.25: 42.25,26.98 C5.2 | U1.28 38.2,27 38.8,26.4 v38.8,25.25 | v6.15,35.5 X1.17 10.75,35.5 11,35.25 11,32.5 | U1.98 24,27 | 24,27 24.62,27.62 | U1.92 U1.P$14 | U1.87 24.5,32.5 U1.P$15 | U1.89 24.5,31.5 U1.P$15 | U1.83 24.5,34.5 U1.P$16 | U1.P$1 24.5,36.5 U1.79 19.25,36.5 | U1.76 21.25,40.23 C8.2 | U1.58 31.5,40.75 | U1.1 23,26 24,27 | 24.62,27.62 U1.P$13 | U1.5 25,27.25 24.62,27.62 | U1.P$15 U1.THERMAL | X1.5 7.5,29.5 7.25,29.25 7.25,28 | 7.25,28 7.25,27.1 v7.5,26.85 | X1.2 7.25,28 | X1.8 10.75,31 11,31.25 11,32.5 | 11,32.5 X1.11 | U1.19 32,21.95
  Top 0.254: U1.4 24.5,27.5 U1.P$13 | 32,21.95 32,21.35 33.15,20.32 33.06,20.23 v33.06,19.14 33.3,18.91 33.3,15.4 | U1.39 38.05,32.5 v38.25,33.65 | U1.45 39.48,35.5 40,36.02 C6.2 | v62.4,33.3 X3.3 58.66,33.3 | v22.6,22.8 23,23.2 U1.1 | 25,23.6 25,22.6 | 31.5,40.75 31.5,41.03 C7.2 | U1.68 26.5,41.33 C3.2 | X3.29 60.7,20.3 v61,20.6 | v63.9,17.55 64.35,17.55 64.35,17.8 | 2.5,24.75 2.5,25.8 | C16.1 37.65,47.35 37.5,47.5 36.6,47.5 | X3.36 58.77,16.8 58.55,17.02 58.55,17.78 58.42,17.91 57.4,17.91 57.28,18.03 | 21.6,13.55 21.6,12.25 v19.35,12.25
  Top 0.305: X1.P$2 8.49,25.86 | Q1.2 35.65,2.35 35.65,4.15 v35.94,4.45 | X2.SPRT@2 5.29,13.07 X2.GND
  Top 0.4: C15.2 v38.8,23.4 | C5.2 v43.75,27 | C11.2 v14.5,24.75 | 8.49,25.86 v7.5,26.85 | v8.49,37.61 v8.5,37.6
  Top 0.406: X1.P$1 v8.49,37.61 | 2.55,40.45 2.55,38.05 | 0.75,39.25 4.3,39.25 | 2.5,25.85 2.5,25.8 | 0.75,24.75 2.5,24.75 | 8.5,25.95 X1.P$2 10.6,24.75 | 21.6,13.55 21.6,14.53 R5.1 | 30.1,44 30.08,44.02 | C3.2 26.1,42.23 27.05,43.18 27.13,43.18 SJ4.2
  Top 0.61: 61.9,35.9 63.7,35.9 | 61.4,37.7 61.4,33.7
  Bottom 0.254: SJ2.1 22.1,13.84 23.24,13.84 23.24,12.19 19.3,12.19
  Bottom 0.4: 30.1,44 30.35,44 | v43.75,27 43.5,27 | v14.5,24.75 14.5,24.5 | v8.5,37.6 8.5,37.4 8.4,37.3
  Bottom 0.406: 2.55,40.35 2.55,38.15 | 4.25,39.25 0.75,39.25 | 8.5,40.5 8.5,38.15 | 6.5,39.25 10.55,39.25 | 0.75,24.75 4.35,24.75 | 8.5,25.95 8.5,23.55 | 6.25,24.75 10.55,24.75 | SJ2.1 20.83,14.73 20.83,14.99
  other vias: 21.15,38.85 42.2,35.9 11.1,17.49 18.65,18 57.33,18.07 20.7,6.8 25.65,17.7 41.4,47.5 57.9,33.3 20.9,47.5 19.05,37.2 29.45,41.35 17.45,12.25 14.13,13.07 15.6,18.05 24.6,13.1 13.9,9.65 19.63,49.08 16.25,45.65 33.49,45.74 33.44,49.13 20.7,9.7 7.54,12.95 10.31,14.66 45,38.6 57.1,49 38.4,38.5 28.07,6.73 26.16,8.89 34.55,9.4 17.14,5.91 62.54,16.16 23.53,47.6 29.37,44.55
  pour Bottom (isolate 0.254, rank 3): 65.89,0 0,0 -0.13,50.89 65.76,50.89
  pour Top (isolate 0.254, rank 2): 66.02,0 0,0 -0.25,50.76 65.76,50.76
HSYNC  (via drill 0.4)
  Top 0.254: X3.32 62.1,18.8 62.7,19.4 62.7,20.3 60.65,22.35 60.65,28.55 v61.1,29 | R12.8 51.6,37.6 v51.9,37.3
  Bottom 0.254: v61.1,29 61.1,29.8 61.7,30.4 61.7,31.2 55.6,37.3 v51.9,37.3
LEDK  (via drill 0.4)
  Top 0.254: X3.1 59.31,34.3 59.2,34.41 v59.2,38.5
  Top 0.406: 45.08,48.2 C19.1 | U4.3 44.67,48.45 C19.1 | v33.25,47.7 32.97,47.95 | 32.97,47.95 29.5,47.95 | 29.5,47.95 27.78,47.95 R17.1 | R16.1 29.5,47.95 | R15.1 31.5,47.9 32.97,47.95 | v51,46.3 49.95,46.3 D2.A 48.44,47.81 48.2,48.05 | 48.2,48.05 48.13,48.12 | C19.1 48.2,48.05
  Bottom 0.406: 59.2,38.65 v59.2,38.5 59.2,38.9 58.55,39.55 57.75,39.55 v51,46.3 34.65,46.3 v33.25,47.7
N$1
  Top 0.25: X1.10 7.75,32 7.25,32.5 5.5,32.5 5,32 5,23.41 7.16,21.25 16.75,21.25 17.5,22 17.5,28.75 18.25,29.5 U1.93
N$2
  Top 0.25: X1.12 5.25,33 4.5,32.25 4.5,23.03 6.78,20.75 17,20.75 18,21.75 18,28.5 18.5,29 U1.94
N$3
  Top 0.25: U1.90 17.75,31 16,29.25 16,23.25 15.75,23 7,23 6.5,23.5 6.5,30.5 7,31 7.25,31 7.75,30.5 X1.7
N$4
  Top 0.25: X1.9 6.75,31.5 6,30.75 6,23.25 6.75,22.5 16,22.5 16.5,23 16.5,29 18,30.5 U1.91
N$5  (via drill 0.4)
  Top 0.25: X1.4 11,29 12,30 12,41.25 12.25,41.5 12.75,41.5 13,41.25 v13,33.75 | U1.85 17.75,33.5 v17.5,33.75
  Bottom 0.25: v17.5,33.75 v13,33.75
N$6  (via drill 0.4)
  Top 0.25: X1.6 11,30 11.5,30.5 11.5,41.5 12,42 13,42 13.5,41.5 13.5,34.85 13.85,34.5 13.85,33.35 v13,32.5 | U1.86 17.95,33 17.5,32.55 v17.5,32.5
  Bottom 0.25: v17.5,32.5 16.75,33.25 13.75,33.25 v13,32.5
N$7  (via drill 0.4)
  Top 0.25: X1.1 11.75,27.5 13.5,29.25 13.5,30.5 15,32 15,42.75 15.25,43 15.75,43 16,42.75 v16,36.75 | U1.80 18.14,36 18,36.14 v18,36.7
  Bottom 0.254: v16,36.75 16.35,36.4 17.7,36.4 v18,36.7
N$8  (via drill 0.4)
  Top 0.25: X1.3 12,28.5 13,29.5 13,30.75 14.5,32.25 14.5,43 15,43.5 16,43.5 16.5,43 16.5,37.7 17,37.2 17,36.5 v16,35.5 | v17.5,35.5 U1.81
  Bottom 0.254: v16,35.5 16.3,35.8 17.2,35.8 v17.5,35.5
N$9
  Top 0.25: X1.19 10.5,36.5 10.75,36.75 10.75,39.47
  Top 0.254: 10.75,39.47 10.75,43.7 11.75,44.7 16.9,44.7 17.68,43.92 R1.1
N$10
  Top 0.203: IC1.2 50.58,5.47 50.77,5.28 50.77,3.86 50.92,3.72 Y1.1
N$11
  Top 0.203: IC1.3 51.86,6.12 Y1.3
N$12
  Top 0.203: IC1.17 43.39,6.77 43.56,6.6 43.56,4.57 C4.1
N$13
  Top 0.254: 24.93,3.96 LED2.C 25.03,4.99 R19.1
N$14  (via drill 0.4)
  Top 0.254: v55.95,33.7 56.2,33.7 57.6,32.3 X3.5 | R6.5 v49,26.8
  Bottom 0.254: v49,26.8 48.31,26.8 47.4,27.71 47.4,30.35 48.7,31.65 50.95,31.65 53,33.7 v55.95,33.7
N$15  (via drill 0.4)
  Top 0.254: v55,32.75 55.25,32.5 56.5,32.5 57.2,31.8 X3.6 | R6.6 v49.9,27.7
  Bottom 0.254: v49.9,27.7 48.4,27.7 48,28.1 48,30 49,31 51.4,31 53.2,32.8 54.85,32.8 v55,32.75
N$16  (via drill 0.4)
  Top 0.254: v53.65,31.8 53.7,31.75 56.25,31.75 56.7,31.3 X3.7 | R6.7 48.95,28.5 v49,28.55
  Bottom 0.254: v49,28.55 49,28.5 48.9,28.5 48.9,29.7 49.5,30.3 52.15,30.3 v53.65,31.8
N$17  (via drill 0.4)
  Top 0.254: R6.8 v49.9,29.4 | X3.8 v60.9,30.8
  Bottom 0.254: v49.9,29.4 52.2,29.4 53.6,30.8 54,30.8 54.45,31.25 55,31.25 55.55,31.8 59.9,31.8 v60.9,30.8
N$18  (via drill 0.4)
  Top 0.254: v55.85,30.75 56.3,30.3 X3.9 | R7.5 49.8,30.9 50.7,30 v50.7,26.6
  Bottom 0.254: v50.7,26.6 51.6,25.7 54.25,25.7 55.85,27.3 v55.85,30.75
N$19  (via drill 0.4)
  Top 0.254: v54.8,30.2 55.2,29.8 X3.10 | R7.6 50,31.8 51.5,30.3 v51.5,28.5
  Bottom 0.254: v51.5,28.5 51.5,27.1 52.25,26.4 53.6,26.4 54.8,27.6 v54.8,30.2
N$20  (via drill 0.4)
  Top 0.254: v53.75,29.65 54.1,29.3 X3.11 | R7.7 50.3,32.6 52.3,30.6 v52.3,27.6
  Bottom 0.254: v52.3,27.6 53.2,27.6 53.75,28.15 v53.75,29.65
N$21
  Top 0.254: R7.8 50.5,33.5 52.9,31.1 52.9,29.2 53.3,28.8 X3.12
N$22  (via drill 0.4)
  Top 0.254: v44.75,25.7 51.7,25.7 54.3,28.3 X3.13 | R8.5 v34.1,16
  Bottom 0.254: v34.1,16 34.1,16.5 43.3,25.7 v44.75,25.7
N$23  (via drill 0.4)
  Top 0.254: v45.75,24.9 51.7,24.9 54.6,27.8 X3.14 | R8.6 34.95,17.2 v34.95,15.2
  Bottom 0.254: v34.95,15.2 34.95,16.3 43.55,24.9 v45.75,24.9
N$24  (via drill 0.4)
  Top 0.254: v46.65,24.1 51.7,24.1 54.9,27.3 X3.15 | R8.7 v35.8,16
  Bottom 0.254: v46.65,24.1 43.9,24.1 v35.8,16
N$25  (via drill 0.4)
  Top 0.254: v47.55,23.3 51.7,23.3 55.2,26.8 X3.16 | R8.8 36.7,16.9 36.9,16.7 v36.9,15.15
  Bottom 0.254: v36.9,15.15 36.9,15.95 44.25,23.3 v47.55,23.3
N$26  (via drill 0.4)
  Top 0.254: v48.45,22.5 51.7,22.5 55.5,26.3 X3.17 | R9.5 v38.2,16
  Bottom 0.254: v38.2,16 38.2,16.35 44.35,22.5 v48.45,22.5
N$27  (via drill 0.4)
  Top 0.254: v49.35,21.7 51.7,21.7 55.8,25.8 X3.18 | R9.6 39.05,17.15 v39.05,15.15
  Bottom 0.254: v39.05,15.15 39.05,16.35 44.4,21.7 v49.35,21.7
N$28  (via drill 0.4)
  Top 0.254: v50.25,20.9 51.7,20.9 56.1,25.3 X3.19 | R9.7 v39.9,16
  Bottom 0.254: v39.9,16 39.9,16.2 44.6,20.9 v50.25,20.9
N$29  (via drill 0.4)
  Top 0.254: v51.15,20.1 51.7,20.1 56.4,24.8 X3.20 | R9.8 40.8,15.15 v40.75,15.15
  Bottom 0.254: v51.15,20.1 44.7,20.1 40.75,16.15 v40.75,15.15
N$30  (via drill 0.4)
  Top 0.254: v45.35,19.3 51.7,19.3 56.7,24.3 X3.21 | R10.5 v25.9,13.2
  Bottom 0.254: v45.35,19.3 41.7,15.65 41.7,14.9 41.15,14.35 28.95,14.35 28.5,14.8 26.3,14.8 25.9,14.4 v25.9,13.2
N$31  (via drill 0.4)
  Top 0.254: v46.25,18.5 51.7,18.5 57,23.8 X3.22 | R10.6 26.75,14.4 v26.75,12.15
  Bottom 0.254: v26.75,12.15 26.75,13.85 27.1,14.2 28.1,14.2 28.45,13.85 41.55,13.85 46.2,18.5 v46.25,18.5
N$32  (via drill 0.4)
  Top 0.254: v47.15,17.7 51.57,17.7 57.17,23.3 X3.23 | R10.7 v27.6,13.2
  Bottom 0.254: v27.6,13.2 27.75,13.35 42.3,13.35 46.7,17.7 v47.15,17.7
N$33  (via drill 0.4)
  Top 0.254: v48.05,16.9 51.45,16.9 57.35,22.8 X3.24 | R10.8 28.45,14.4 v28.45,12.15
  Bottom 0.254: v28.45,12.15 29.15,12.85 43.4,12.85 47.5,16.9 v48.05,16.9
N$34  (via drill 0.4)
  Top 0.254: v48.95,16.1 51.32,16.1 57.52,22.3 X3.25 | R11.5 30,12.2 v29.75,11.95
  Bottom 0.254: v29.75,11.95 30.15,12.35 43.85,12.35 47.6,16.1 v48.95,16.1
N$35  (via drill 0.4)
  Top 0.254: v49.85,15.3 51.19,15.3 57.69,21.8 X3.26 | R11.6 30.9,11.7 v31.05,11.45
  Bottom 0.254: v31.05,11.45 31.45,11.85 44.35,11.85 47.8,15.3 v49.85,15.3
N$36  (via drill 0.4)
  Top 0.254: v50.75,14.5 51.06,14.5 57.87,21.3 X3.27 | R11.7 31.7,12.6 32.35,11.95 v32.35,10.85
  Bottom 0.254: v32.35,10.85 32.85,11.35 44.85,11.35 48,14.5 v50.75,14.5
N$38
  Top 0.25: U1.97 19.75,27.5 19.5,27.25 19.5,21.27 C10.1
  Top 0.254: FB4.2 17.68,17.28 17.68,18.45 17.68,19.08 C10.1
N$39  (via drill 0.4)
  Top 0.254: v51.65,13.7 51.7,14.46 58.04,20.8 X3.28 | R11.8 32.6,12.95 33.65,11.9 v33.65,10.25
  Bottom 0.254: v33.65,10.25 34.25,10.85 45.25,10.85 48.1,13.7 v51.65,13.7
N$40
  Top 0.203: IC1.11 43.92,10.67 43.92,11.3 R13.2
N$41
  Top 0.203: LED1.C 55.8,1.78 55.8,2.39 R14.1
N$42  (via drill 0.4)
  Top 0.25: 39.55,34.5 U1.43 35.5,34.5 | 20.25,37 U1.78 22.3,37 22.5,37.2 22.5,38.1 22.9,38.5 32,38.5 | 19.25,40.23 C8.1 | 35.5,34.5 35.5,38.2 35.2,38.5 32,38.5 | U1.57 32,38.5 | 35.5,34.5 35.5,27.5 U1.29 38.8,27.5 39.3,27 C5.1 FB2.2 40.2,25.17
  Top 0.254: v31.9,19.95 31.5,20.35 U1.18 31.5,25.3 31.7,25.5 35.2,25.5 35.5,25.8 35.5,27.5 | 39.55,34.5 40.28,34.5 C6.1 | U1.57 32,41.03 C7.1 | 20.25,37 20,37.25 20,39.48 C8.1
N$43
  Top 0.203: IC1.5 53.41,7.42 53.72,7.11 53.72,1.78 LED1.A
N$45
  Top 0.254: LED3.C 40.44,1.4 R20.1
N$46
  Top 0.254: Q1.3 R20.2
N$47
  Top 0.406: D1.A 43.3,40.2 L1.P$2 42.7,42 U4.1
N$48
  Top 0.203: R21.2 33.34,6.73 34.63,5.44 Q1.1
N$49
  Top 0.406: R15.2 31.75,45.49 SJ3.2
N$50
  Top 0.254: SJ4.1 25.94,45.37 26.42,45.85 26.75,45.85 R17.2
N$52  (via drill 0.39, 0.4)
  Top 0.254: v38.65,48.35 35.53,48.35 R18.2 | D3.A 51.65,48.51 v51.56,48.6
  Top 0.406: U4.4 38.75,48.45 v38.65,48.35
  Bottom 0.254: JP1.2 61.9,40.8 58.2,40.8 55.8,43.2 55.8,45 52.2,48.6 v51.56,48.6 38.9,48.6 v38.65,48.35
N$53
  Top 0.254: X3.39 58.99,15.3 58.67,14.99 FB5.2
N$54
  Top 0.254: X3.40 63.56,14.8 64.14,14.22 64.14,10.41 FB6.2
N$55
  Top 0.203: IC1.4 48.8,6.77 48.64,6.61 48.64,4.82 | 48.64,4.82 48.64,3.94 C1.2 | IC1.1 48.64,4.82
  Top 0.305: FB7.1 C1.2
N$56
  Top 0.254: X3.37 58.21,16.3 FB9.2
N$57
  Top 0.254: X3.38 58.73,15.8 57.66,14.73 FB10.2
OCK_INV  (via drill 0.4)
  Top 0.25: U1.100 22.25,26 22.5,25.75 22.5,24.25 v21.25,23
  Top 0.254: v22.1,18.7 22.1,16.67 R5.2
  Bottom 0.254: v21.25,23 21.25,22.55 22.1,21.7 v22.1,18.7 20.12,18.7 19.5,18.08 SJ1.1
PIXCLK  (via drill 0.4)
  Top 0.254: X3.30 v61.85,19.8 | R12.5 50.4,35 v51.6,33.8
  Bottom 0.254: v61.85,19.8 61.85,21.15 58.05,25 49.11,25 46.8,27.31 46.8,30.8 48.3,32.3 50.1,32.3 v51.6,33.8
R0
  Top 0.254: U1.30 44.1,28 45.3,26.8 R6.4
R1
  Top 0.254: U1.31 44.4,28.5 45.2,27.7 R6.3
R2
  Top 0.254: U1.32 44.7,29 45.2,28.5 R6.2
R3
  Top 0.254: U1.33 45.05,29.5 45.15,29.4 R6.1
R4
  Top 0.254: U1.34 45,30 45.9,30.9 R7.4
R5
  Top 0.254: U1.35 43.7,30.5 45,31.8 R7.3
R6
  Top 0.254: U1.36 42.2,31 43.8,32.6 R7.2
R7
  Top 0.254: U1.37 40.65,31.5 42.65,33.5 R7.1
SCL  (via drill 0.4)
  Top 0.25: X1.15 7.35,34.5 6.75,33.9 5.1,33.9
  Top 0.254: U2.1 20.4,48.45 19.9,47.95 v19.9,45.45 R3.1 | 5.1,33.9 4.55,34.45 4.55,36.8 5.6,37.85 5.6,39.8 6.9,41.1 8.3,41.1 9.5,42.3 9.5,44.3 11.2,46 13.07,46 JP7.3
  Bottom 0.254: JP7.3 17.62,45.45 v19.9,45.45
SDA  (via drill 0.4)
  Top 0.25: X1.16 7,35 6.5,34.5 5.35,34.5
  Top 0.254: U2.3 22.1,46.55 v22.1,45.45 R4.1 | 5.35,34.5 5.15,34.7 5.15,36.1 6.4,37.35 6.4,39.8 7.1,40.5 8.7,40.5 10.1,41.9 10.1,44 11.5,45.4 13.3,45.4 14.5,46.6 16.21,46.6 JP7.4
  Bottom 0.254: JP7.4 19.31,46.3 21.25,46.3 v22.1,45.45
ST  (via drill 0.4)
  Top 0.254: R2.2 23.7,17.02 v23.7,18.7 | U1.3 24,22.15 v23.6,21.75
  Bottom 0.254: v23.6,21.75 23.6,18.8 v23.7,18.7 23.7,17.1 23.37,16.77 SJ2.2
VDD  (via drill 0.4)
  Top 0.203: v33.15,4.45 33.66,3.94 33.66,1.78 33.91,1.52 LED3.A
  Top 0.254: 60.8,32.8 X3.4 | C15.1 FB2.1 | U3.4 22.86,2.15 | 22.86,2.15 27.68,2.15 SJ6.1 C23.1 | LED2.A 22.86,3.49 22.86,2.15
  Top 0.305: 62.2,31.4 60.8,32.8
  Top 0.4: 42.2,25.13 FB2.1
  Top 0.406: C14.1 21.82,5.2 18.4,5.2
  Top 0.61: v61.45,27.75 62.2,28.5 62.2,31.4 | C15.1 42.22,20.93 42.9,20.25 42.9,14.49 40.6,12.19 39.75,12.19 37.02,9.5 v36.2,9.5 | v18.4,13.1 FB4.1 | FB3.1 FB4.1 | FB4.1 FB1.1 | JP6.1 12.87,2.15 U3.4
  Top 0.813: U3.4 18.4,5.2 v18.4,6.75 U3.2
  Bottom 0.254: 18.4,6.7 v18.4,6.75
  Bottom 0.61: v61.45,27.75 61.3,27.6 61.3,23.2 63,21.5 63,19.4 59.43,15.83 56.09,15.83 52.32,12.06 48.44,12.06 45.87,9.5 v36.2,9.5 33.15,6.45 v33.15,4.45 33,4.3 20.8,4.3 18.4,6.7 | v18.4,13.1 v18.4,6.75
VDDIO  (via drill 0.4)
  Top 0.203: FB1.2 20.75,16.57 20.75,15.95 21.15,15.55 22.94,15.55 23.39,15.1 23.39,14.53 R2.1 23.37,14.53 23.37,13.97 v22.48,13.08
  Top 0.25: U1.99 20.25,26.5 20,26.25 20,22.88 21.25,21.63 21.25,19.9 | U1.6 25.5,23.3 25.8,23 26,23.2 U1.7
  Top 0.254: U1.38 38.5,32 v39.45,32.95 | 25.8,23 25.8,21.02 C2.1 | 20.2,16.45 FB1.2 20.7,17.07 20.7,17.3 21.25,17.85 21.25,19.9 21.3,19.9 | U1.67 27,40.73 C3.1
  Top 0.406: C2.1 26.12,21.02 v24.87,19.9 21.3,19.9 | C3.1 28.3,41.8 v29.6,43.1
  Bottom 0.254: SJ1.2 19.5,14.61 20.07,14.61 20.07,13.44 20.43,13.08 v22.48,13.08
  Bottom 0.406: v29.6,43.1 30.9,41.8 38.35,41.8 39.45,40.7 v39.45,32.95 32.5,26 26.5,26 24.87,24.37 v24.87,19.9
VIN  (via drill 0.4)
  Top 0.254: 35.3,46.4 R18.1 v35.3,44.6 | v9.8,16.25 11.66,16.25 C12.1
  Top 0.305: X2.VBUS 9.35,15.8 v9.8,16.25
  Top 0.406: 9.65,16.1 v9.8,16.25 9.8,16.98 C26.+ | v39.7,44.6 L1.P$1 39.7,39.7 v37.7,39.7 | v39.7,44.6 39.7,46.55 U4.5 | v16.1,6.75 15.63,6.28 C13.1 | C16.2 38.07,44.6 v39.7,44.6
  Top 0.813: v16.1,6.75 U3.3
  Bottom 0.254: v35.3,44.6 v39.7,44.6
  Bottom 0.406: v37.7,39.7 34.95,36.95 32.55,36.95 32,36.4 32,35 26,29 24.5,29 19.75,24.25 19.75,20.45 16.1,16.8 16.1,16.25 | 16.1,16.25 v16.1,6.75 | 16.1,16.25 v9.8,16.25 7.24,18.81 7.24,20.57 4.95,22.86 3.05,22.86 1.65,21.46 JP2.1
VSYNC  (via drill 0.4)
  Top 0.254: X3.33 62.4,18.3 63.25,19.15 63.25,22.4 62.3,23.35 v62.3,26.8 | R12.7 v50.6,36.7
  Bottom 0.254: v50.6,36.7 50.6,37.88 51.02,38.3 55.4,38.3 62.4,31.4 62.4,27.3 62.3,27.2 v62.3,26.8
X+  (via drill 0.4)
  Top 0.203: v51.82,8.34 51.44,8.76 49.82,8.76 arc45 IC1.7
  Top 0.254: FB9.1 54.61,16.38 52.58,14.48 52.58,12.45 C25.1 51.82,12.06 51.05,11.56 51.05,9.1 v51.82,8.34
  Bottom 0.203: 55.88,9.65 54.57,8.34 v51.82,8.34
X-  (via drill 0.39)
  Top 0.203: IC1.14 44.83,8.72 45.97,9.87 45.97,11.33 R13.1
  Top 0.254: C21.1 FB5.1 56.39,12.32 v55.37,12.32 | R13.1 46.46,9.93 v47.88,8.51
  Bottom 0.254: v47.88,8.51 49.15,8.51 51.05,10.41 53.21,10.41 v55.37,12.32
XCV
  Top 0.254: U1.48 38.4,37 39.6,38.2 43,38.2 43.6,37.6 R12.1
Y+  (via drill 0.39, 0.4)
  Top 0.203: IC1.15 43.81,8.07 v44.58,7.31
  Top 0.254: C24.1 53.98,13.72 54.74,14.48 55.5,14.48 FB10.1 56.64,13.59 v56.64,13.46
  Bottom 0.203: 56.13,11.3 54.48,9.65 51.44,9.65 49.09,7.31 v44.58,7.31
  Bottom 0.254: 56.13,11.3 56.13,12.95 v56.64,13.46
Y-  (via drill 0.4)
  Top 0.203: IC1.16 43.38,7.42 v44.96,5.84
  Top 0.254: FB6.1 C22.1 60.2,10.29 59.69,9.27 57.91,8.89 56.01,6.99 v55.63,6.99
  Bottom 0.203: v44.96,5.84 49.4,5.84 50.67,7.11 54.99,7.11 v55.63,6.99
ZXC
  Top 0.254: U1.44 R12.4

### Text on the board
tPlace: +5V | GND | SCL | SDA | EDID / EEPROM | GND | Backlight | TFP401 | 5V | GND | 40-Pin TTL RGB | HDMI/DVI Decoder Breakout | (w/AR1100 USB Touch) | GND | +3V3 | PWR | HDMI | Touch
bPlace: +5V | GND | SCL | SDA | Backlite / Jumpers | +25mA | +100mA | GND | Backlight | 5V | GND | OCK_INV | ST | GND | +3V3